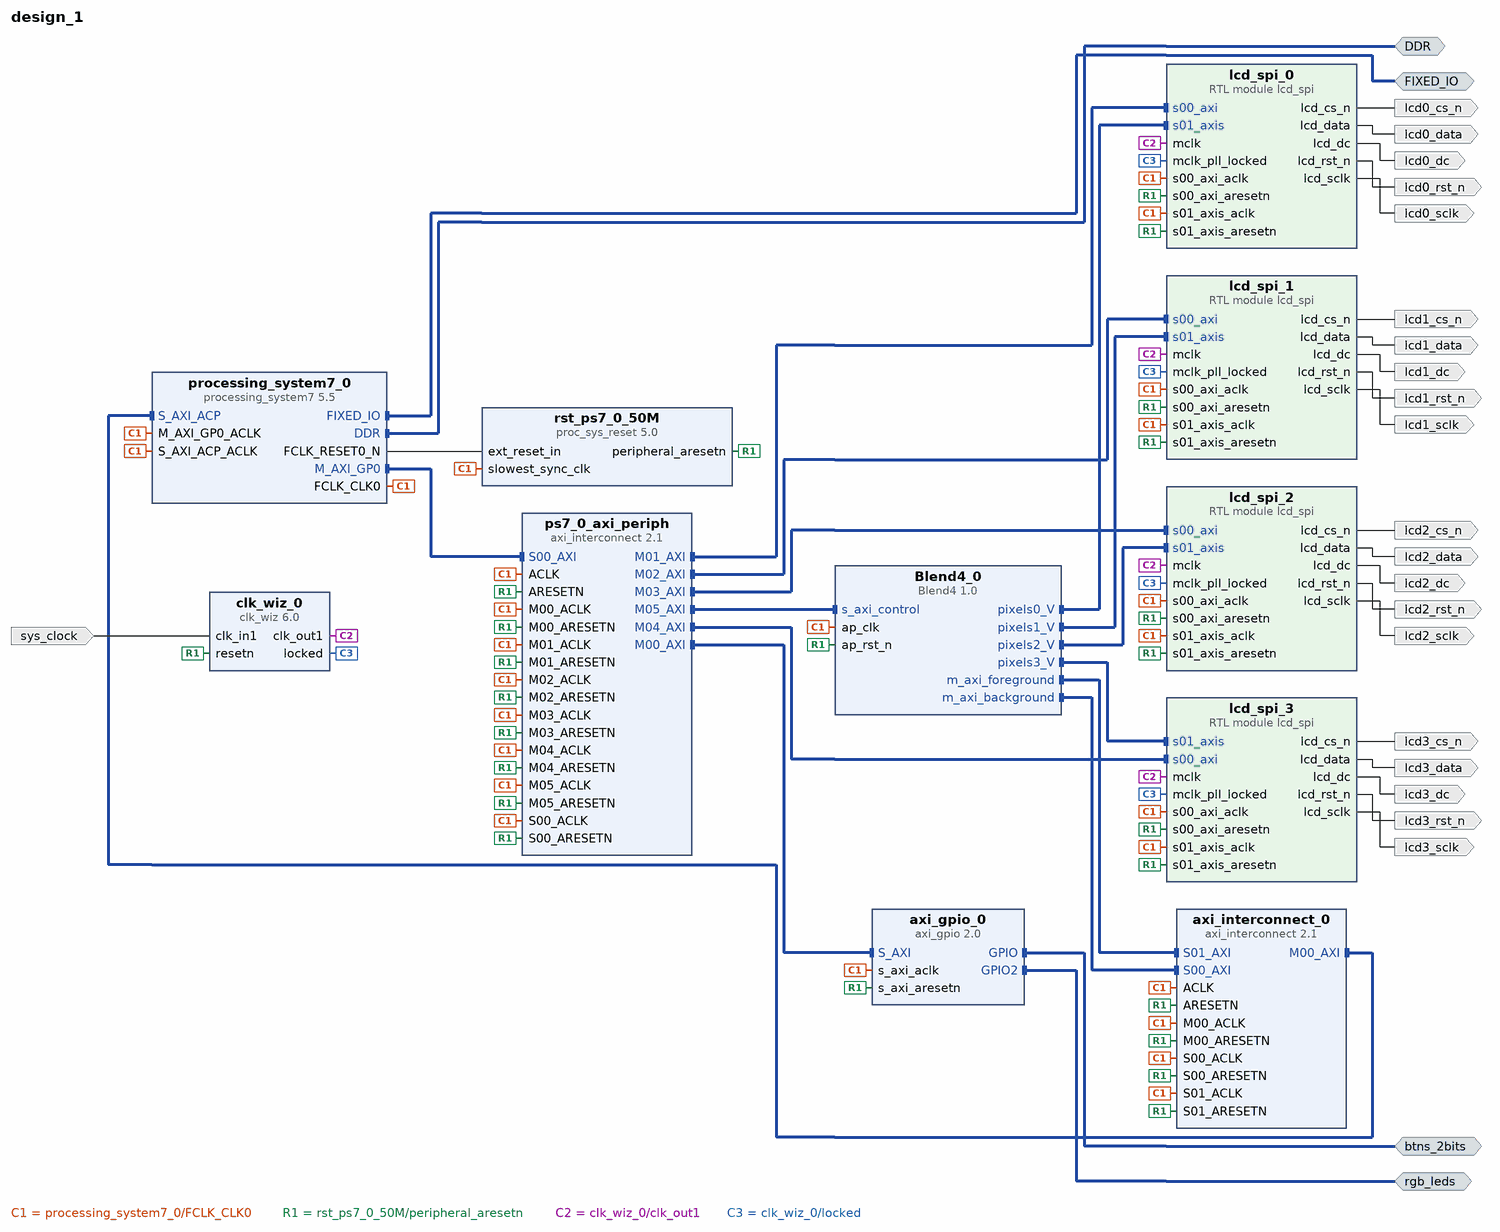
[diagram p0: block diagram of the top level]
# Vivado block design design_1, xc7z007sclg400-1, Vivado 2020.2
create_bd_design design_1

create_bd_intf_port -mode Master -vlnv xilinx.com:interface:gpio_rtl:1.0 btns_2bits
create_bd_intf_port -mode Master -vlnv xilinx.com:interface:gpio_rtl:1.0 rgb_leds
create_bd_intf_port -mode Master -vlnv xilinx.com:interface:ddrx_rtl:1.0 DDR
create_bd_intf_port -mode Master -vlnv xilinx.com:display_processing_system7:fixedio_rtl:1.0 FIXED_IO
create_bd_port -dir O lcd0_rst_n
create_bd_port -dir O lcd1_rst_n
create_bd_port -dir O lcd2_rst_n
create_bd_port -dir O lcd3_rst_n
create_bd_port -dir O lcd0_cs_n
create_bd_port -dir O lcd1_cs_n
create_bd_port -dir O lcd2_cs_n
create_bd_port -dir O lcd3_cs_n
create_bd_port -dir O lcd0_dc
create_bd_port -dir O lcd1_dc
create_bd_port -dir O lcd2_dc
create_bd_port -dir O lcd3_dc
create_bd_port -dir O lcd0_sclk
create_bd_port -dir O lcd1_sclk
create_bd_port -dir O lcd2_sclk
create_bd_port -dir O lcd3_sclk
create_bd_port -dir O lcd0_data
create_bd_port -dir O lcd1_data
create_bd_port -dir O lcd2_data
create_bd_port -dir O lcd3_data
create_bd_port -dir I -type clk sys_clock
set_property -dict {CONFIG.FREQ_HZ 125000000 CONFIG.PHASE 0.000} [get_bd_ports sys_clock]

create_bd_cell -type ip -vlnv xilinx.com:ip:axi_gpio:2.0 axi_gpio_0
set_property -dict [list \
  CONFIG.GPIO2_BOARD_INTERFACE rgb_leds \
  CONFIG.GPIO_BOARD_INTERFACE btns_2bits \
  CONFIG.USE_BOARD_FLOW true \
] [get_bd_cells axi_gpio_0]
create_bd_cell -type ip -vlnv xilinx.com:ip:processing_system7:5.5 processing_system7_0
set_property -dict [list \
  CONFIG.PCW_APU_PERIPHERAL_FREQMHZ 650 \
  CONFIG.PCW_CRYSTAL_PERIPHERAL_FREQMHZ 50 \
  CONFIG.PCW_ENET0_ENET0_IO {MIO 16 .. 27} \
  CONFIG.PCW_ENET0_GRP_MDIO_ENABLE 1 \
  CONFIG.PCW_ENET0_GRP_MDIO_IO {MIO 52 .. 53} \
  CONFIG.PCW_ENET0_PERIPHERAL_ENABLE 1 \
  CONFIG.PCW_ENET0_RESET_ENABLE 1 \
  CONFIG.PCW_ENET0_RESET_IO {MIO 9} \
  CONFIG.PCW_ENET_RESET_ENABLE 1 \
  CONFIG.PCW_ENET_RESET_SELECT {Share reset pin} \
  CONFIG.PCW_GPIO_MIO_GPIO_ENABLE 1 \
  CONFIG.PCW_GPIO_MIO_GPIO_IO MIO \
  CONFIG.PCW_I2C_RESET_ENABLE 1 \
  CONFIG.PCW_PRESET_BANK1_VOLTAGE {LVCMOS 1.8V} \
  CONFIG.PCW_QSPI_PERIPHERAL_ENABLE 0 \
  CONFIG.PCW_SD0_GRP_CD_ENABLE 1 \
  CONFIG.PCW_SD0_GRP_CD_IO {MIO 47} \
  CONFIG.PCW_SD0_GRP_WP_ENABLE 0 \
  CONFIG.PCW_SD0_PERIPHERAL_ENABLE 1 \
  CONFIG.PCW_SD0_SD0_IO {MIO 40 .. 45} \
  CONFIG.PCW_SDIO_PERIPHERAL_FREQMHZ 100 \
  CONFIG.PCW_UART0_PERIPHERAL_ENABLE 1 \
  CONFIG.PCW_UART0_UART0_IO {MIO 14 .. 15} \
  CONFIG.PCW_UART_PERIPHERAL_FREQMHZ 100 \
  CONFIG.PCW_UIPARAM_DDR_BUS_WIDTH {16 Bit} \
  CONFIG.PCW_UIPARAM_DDR_FREQ_MHZ 525 \
  CONFIG.PCW_UIPARAM_DDR_PARTNO {MT41K256M16 RE-125} \
  CONFIG.PCW_USB0_PERIPHERAL_ENABLE 1 \
  CONFIG.PCW_USB0_RESET_ENABLE 1 \
  CONFIG.PCW_USB0_RESET_IO {MIO 46} \
  CONFIG.PCW_USB0_USB0_IO {MIO 28 .. 39} \
  CONFIG.PCW_USB_RESET_ENABLE 1 \
  CONFIG.PCW_USB_RESET_SELECT {Share reset pin} \
  CONFIG.PCW_USE_DEFAULT_ACP_USER_VAL 1 \
  CONFIG.PCW_USE_S_AXI_ACP 1 \
] [get_bd_cells processing_system7_0]
# 292 more settings of processing_system7_0 are not shown: defaults, MIO pin electricals, DDR timing, and values the tool derives
create_bd_cell -type ip -vlnv xilinx.com:ip:axi_interconnect:2.1 ps7_0_axi_periph
set_property -dict {CONFIG.NUM_MI 6} [get_bd_cells ps7_0_axi_periph]
create_bd_cell -type ip -vlnv xilinx.com:ip:proc_sys_reset:5.0 rst_ps7_0_50M
create_bd_cell -type module -reference lcd_spi lcd_spi_0
create_bd_cell -type module -reference lcd_spi lcd_spi_1
create_bd_cell -type module -reference lcd_spi lcd_spi_2
create_bd_cell -type module -reference lcd_spi lcd_spi_3
create_bd_cell -type ip -vlnv xilinx.com:ip:clk_wiz:6.0 clk_wiz_0
set_property -dict [list \
  CONFIG.CLKOUT1_JITTER 136.480 \
  CONFIG.CLKOUT1_REQUESTED_OUT_FREQ 64 \
  CONFIG.CLK_IN1_BOARD_INTERFACE sys_clock \
  CONFIG.MMCM_CLKOUT0_DIVIDE_F 15.625 \
  CONFIG.RESET_PORT resetn \
  CONFIG.RESET_TYPE ACTIVE_LOW \
  CONFIG.USE_BOARD_FLOW true \
] [get_bd_cells clk_wiz_0]
create_bd_cell -type ip -vlnv xilinx.com:ip:axi_interconnect:2.1 axi_interconnect_0
set_property -dict {CONFIG.NUM_MI 1 CONFIG.NUM_SI 2} [get_bd_cells axi_interconnect_0]
create_bd_cell -type ip -vlnv xilinx.com:hls:Blend4:1.0 Blend4_0

# ---- connections ----

connect_bd_intf_net [get_bd_intf_ports rgb_leds] [get_bd_intf_pins axi_gpio_0/GPIO2]
connect_bd_intf_net [get_bd_intf_pins ps7_0_axi_periph/M03_AXI] [get_bd_intf_pins lcd_spi_2/s00_axi]
connect_bd_intf_net [get_bd_intf_ports btns_2bits] [get_bd_intf_pins axi_gpio_0/GPIO]
connect_bd_intf_net [get_bd_intf_pins ps7_0_axi_periph/M04_AXI] [get_bd_intf_pins lcd_spi_3/s00_axi]
connect_bd_intf_net [get_bd_intf_pins Blend4_0/pixels2_V] [get_bd_intf_pins lcd_spi_2/s01_axis]
connect_bd_intf_net [get_bd_intf_pins ps7_0_axi_periph/M00_AXI] [get_bd_intf_pins axi_gpio_0/S_AXI]
connect_bd_intf_net [get_bd_intf_pins Blend4_0/m_axi_foreground] [get_bd_intf_pins axi_interconnect_0/S01_AXI]
connect_bd_intf_net [get_bd_intf_ports FIXED_IO] [get_bd_intf_pins processing_system7_0/FIXED_IO]
connect_bd_intf_net [get_bd_intf_ports DDR] [get_bd_intf_pins processing_system7_0/DDR]
connect_bd_intf_net [get_bd_intf_pins ps7_0_axi_periph/M02_AXI] [get_bd_intf_pins lcd_spi_1/s00_axi]
connect_bd_intf_net [get_bd_intf_pins Blend4_0/pixels0_V] [get_bd_intf_pins lcd_spi_0/s01_axis]
connect_bd_intf_net [get_bd_intf_pins ps7_0_axi_periph/M01_AXI] [get_bd_intf_pins lcd_spi_0/s00_axi]
connect_bd_intf_net [get_bd_intf_pins Blend4_0/s_axi_control] [get_bd_intf_pins ps7_0_axi_periph/M05_AXI]
connect_bd_intf_net [get_bd_intf_pins Blend4_0/pixels1_V] [get_bd_intf_pins lcd_spi_1/s01_axis]
connect_bd_intf_net [get_bd_intf_pins processing_system7_0/M_AXI_GP0] [get_bd_intf_pins ps7_0_axi_periph/S00_AXI]
connect_bd_intf_net [get_bd_intf_pins Blend4_0/m_axi_background] [get_bd_intf_pins axi_interconnect_0/S00_AXI]
connect_bd_intf_net [get_bd_intf_pins axi_interconnect_0/M00_AXI] [get_bd_intf_pins processing_system7_0/S_AXI_ACP]
connect_bd_intf_net [get_bd_intf_pins Blend4_0/pixels3_V] [get_bd_intf_pins lcd_spi_3/s01_axis]
connect_bd_net [get_bd_pins processing_system7_0/FCLK_CLK0] \
  [get_bd_pins processing_system7_0/M_AXI_GP0_ACLK] [get_bd_pins ps7_0_axi_periph/S00_ACLK] \
  [get_bd_pins rst_ps7_0_50M/slowest_sync_clk] [get_bd_pins axi_gpio_0/s_axi_aclk] [get_bd_pins ps7_0_axi_periph/M00_ACLK] \
  [get_bd_pins ps7_0_axi_periph/ACLK] [get_bd_pins lcd_spi_0/s00_axi_aclk] [get_bd_pins ps7_0_axi_periph/M01_ACLK] \
  [get_bd_pins lcd_spi_1/s00_axi_aclk] [get_bd_pins ps7_0_axi_periph/M02_ACLK] [get_bd_pins lcd_spi_2/s00_axi_aclk] \
  [get_bd_pins ps7_0_axi_periph/M03_ACLK] [get_bd_pins lcd_spi_3/s00_axi_aclk] [get_bd_pins ps7_0_axi_periph/M04_ACLK] \
  [get_bd_pins lcd_spi_3/s01_axis_aclk] [get_bd_pins lcd_spi_2/s01_axis_aclk] [get_bd_pins lcd_spi_1/s01_axis_aclk] \
  [get_bd_pins lcd_spi_0/s01_axis_aclk] [get_bd_pins processing_system7_0/S_AXI_ACP_ACLK] \
  [get_bd_pins axi_interconnect_0/ACLK] [get_bd_pins axi_interconnect_0/S00_ACLK] [get_bd_pins axi_interconnect_0/M00_ACLK] \
  [get_bd_pins axi_interconnect_0/S01_ACLK] [get_bd_pins Blend4_0/ap_clk] [get_bd_pins ps7_0_axi_periph/M05_ACLK]
connect_bd_net [get_bd_pins processing_system7_0/FCLK_RESET0_N] [get_bd_pins rst_ps7_0_50M/ext_reset_in]
connect_bd_net [get_bd_pins rst_ps7_0_50M/peripheral_aresetn] \
  [get_bd_pins ps7_0_axi_periph/S00_ARESETN] [get_bd_pins axi_gpio_0/s_axi_aresetn] \
  [get_bd_pins ps7_0_axi_periph/M00_ARESETN] [get_bd_pins ps7_0_axi_periph/ARESETN] [get_bd_pins lcd_spi_0/s00_axi_aresetn] \
  [get_bd_pins ps7_0_axi_periph/M01_ARESETN] [get_bd_pins lcd_spi_1/s00_axi_aresetn] \
  [get_bd_pins ps7_0_axi_periph/M02_ARESETN] [get_bd_pins lcd_spi_2/s00_axi_aresetn] \
  [get_bd_pins ps7_0_axi_periph/M03_ARESETN] [get_bd_pins lcd_spi_3/s00_axi_aresetn] \
  [get_bd_pins ps7_0_axi_periph/M04_ARESETN] [get_bd_pins lcd_spi_0/s01_axis_aresetn] \
  [get_bd_pins lcd_spi_1/s01_axis_aresetn] [get_bd_pins lcd_spi_2/s01_axis_aresetn] [get_bd_pins lcd_spi_3/s01_axis_aresetn] \
  [get_bd_pins clk_wiz_0/resetn] [get_bd_pins axi_interconnect_0/ARESETN] [get_bd_pins axi_interconnect_0/S00_ARESETN] \
  [get_bd_pins axi_interconnect_0/M00_ARESETN] [get_bd_pins axi_interconnect_0/S01_ARESETN] [get_bd_pins Blend4_0/ap_rst_n] \
  [get_bd_pins ps7_0_axi_periph/M05_ARESETN]
connect_bd_net [get_bd_pins lcd_spi_3/lcd_sclk] [get_bd_ports lcd3_sclk]
connect_bd_net [get_bd_pins lcd_spi_3/lcd_data] [get_bd_ports lcd3_data]
connect_bd_net [get_bd_pins lcd_spi_3/lcd_rst_n] [get_bd_ports lcd3_rst_n]
connect_bd_net [get_bd_pins lcd_spi_3/lcd_dc] [get_bd_ports lcd3_dc]
connect_bd_net [get_bd_pins lcd_spi_3/lcd_cs_n] [get_bd_ports lcd3_cs_n]
connect_bd_net [get_bd_pins lcd_spi_2/lcd_data] [get_bd_ports lcd2_data]
connect_bd_net [get_bd_pins lcd_spi_2/lcd_sclk] [get_bd_ports lcd2_sclk]
connect_bd_net [get_bd_pins lcd_spi_2/lcd_dc] [get_bd_ports lcd2_dc]
connect_bd_net [get_bd_pins lcd_spi_2/lcd_cs_n] [get_bd_ports lcd2_cs_n]
connect_bd_net [get_bd_pins lcd_spi_2/lcd_rst_n] [get_bd_ports lcd2_rst_n]
connect_bd_net [get_bd_pins lcd_spi_1/lcd_data] [get_bd_ports lcd1_data]
connect_bd_net [get_bd_pins lcd_spi_0/lcd_rst_n] [get_bd_ports lcd0_rst_n]
connect_bd_net [get_bd_pins lcd_spi_0/lcd_sclk] [get_bd_ports lcd0_sclk]
connect_bd_net [get_bd_pins lcd_spi_1/lcd_sclk] [get_bd_ports lcd1_sclk]
connect_bd_net [get_bd_pins lcd_spi_0/lcd_cs_n] [get_bd_ports lcd0_cs_n]
connect_bd_net [get_bd_pins lcd_spi_0/lcd_dc] [get_bd_ports lcd0_dc]
connect_bd_net [get_bd_pins lcd_spi_0/lcd_data] [get_bd_ports lcd0_data]
connect_bd_net [get_bd_pins lcd_spi_1/lcd_cs_n] [get_bd_ports lcd1_cs_n]
connect_bd_net [get_bd_pins lcd_spi_1/lcd_dc] [get_bd_ports lcd1_dc]
connect_bd_net [get_bd_pins lcd_spi_1/lcd_rst_n] [get_bd_ports lcd1_rst_n]
connect_bd_net [get_bd_ports sys_clock] [get_bd_pins clk_wiz_0/clk_in1]
connect_bd_net [get_bd_pins clk_wiz_0/clk_out1] \
  [get_bd_pins lcd_spi_0/mclk] [get_bd_pins lcd_spi_1/mclk] [get_bd_pins lcd_spi_2/mclk] [get_bd_pins lcd_spi_3/mclk]
connect_bd_net [get_bd_pins clk_wiz_0/locked] \
  [get_bd_pins lcd_spi_3/mclk_pll_locked] [get_bd_pins lcd_spi_2/mclk_pll_locked] [get_bd_pins lcd_spi_1/mclk_pll_locked] \
  [get_bd_pins lcd_spi_0/mclk_pll_locked]

# ---- address map ----
assign_bd_address -offset 0x0000000000000000 -range 512M -target_address_space [get_bd_addr_spaces Blend4_0/Data_m_axi_background] [get_bd_addr_segs processing_system7_0/S_AXI_ACP/ACP_DDR_LOWOCM]
assign_bd_address -offset 0x0000000040000000 -range 1G -target_address_space [get_bd_addr_spaces Blend4_0/Data_m_axi_background] [get_bd_addr_segs processing_system7_0/S_AXI_ACP/ACP_M_AXI_GP0]
assign_bd_address -offset 0x00000000E0000000 -range 4M -target_address_space [get_bd_addr_spaces Blend4_0/Data_m_axi_background] [get_bd_addr_segs processing_system7_0/S_AXI_ACP/ACP_IOP]
assign_bd_address -offset 0x0000000000000000 -range 512M -target_address_space [get_bd_addr_spaces Blend4_0/Data_m_axi_foreground] [get_bd_addr_segs processing_system7_0/S_AXI_ACP/ACP_DDR_LOWOCM]
assign_bd_address -offset 0x0000000040000000 -range 1G -target_address_space [get_bd_addr_spaces Blend4_0/Data_m_axi_foreground] [get_bd_addr_segs processing_system7_0/S_AXI_ACP/ACP_M_AXI_GP0]
assign_bd_address -offset 0x00000000E0000000 -range 4M -target_address_space [get_bd_addr_spaces Blend4_0/Data_m_axi_foreground] [get_bd_addr_segs processing_system7_0/S_AXI_ACP/ACP_IOP]
assign_bd_address -offset 0x40000000 -range 64K -target_address_space [get_bd_addr_spaces processing_system7_0/Data] [get_bd_addr_segs Blend4_0/s_axi_control/Reg]
assign_bd_address -offset 0x41200000 -range 64K -target_address_space [get_bd_addr_spaces processing_system7_0/Data] [get_bd_addr_segs axi_gpio_0/S_AXI/Reg]
assign_bd_address -offset 0x43C00000 -range 64K -target_address_space [get_bd_addr_spaces processing_system7_0/Data] [get_bd_addr_segs lcd_spi_0/s00_axi/reg0]
assign_bd_address -offset 0x43C10000 -range 64K -target_address_space [get_bd_addr_spaces processing_system7_0/Data] [get_bd_addr_segs lcd_spi_1/s00_axi/reg0]
assign_bd_address -offset 0x43C20000 -range 64K -target_address_space [get_bd_addr_spaces processing_system7_0/Data] [get_bd_addr_segs lcd_spi_2/s00_axi/reg0]
assign_bd_address -offset 0x43C30000 -range 64K -target_address_space [get_bd_addr_spaces processing_system7_0/Data] [get_bd_addr_segs lcd_spi_3/s00_axi/reg0]

validate_bd_design
save_bd_design
